# Altium schematic sheet 05_Connectors_Debug.SchDoc
size A; SheetNumber: 6; SheetTotal: 6
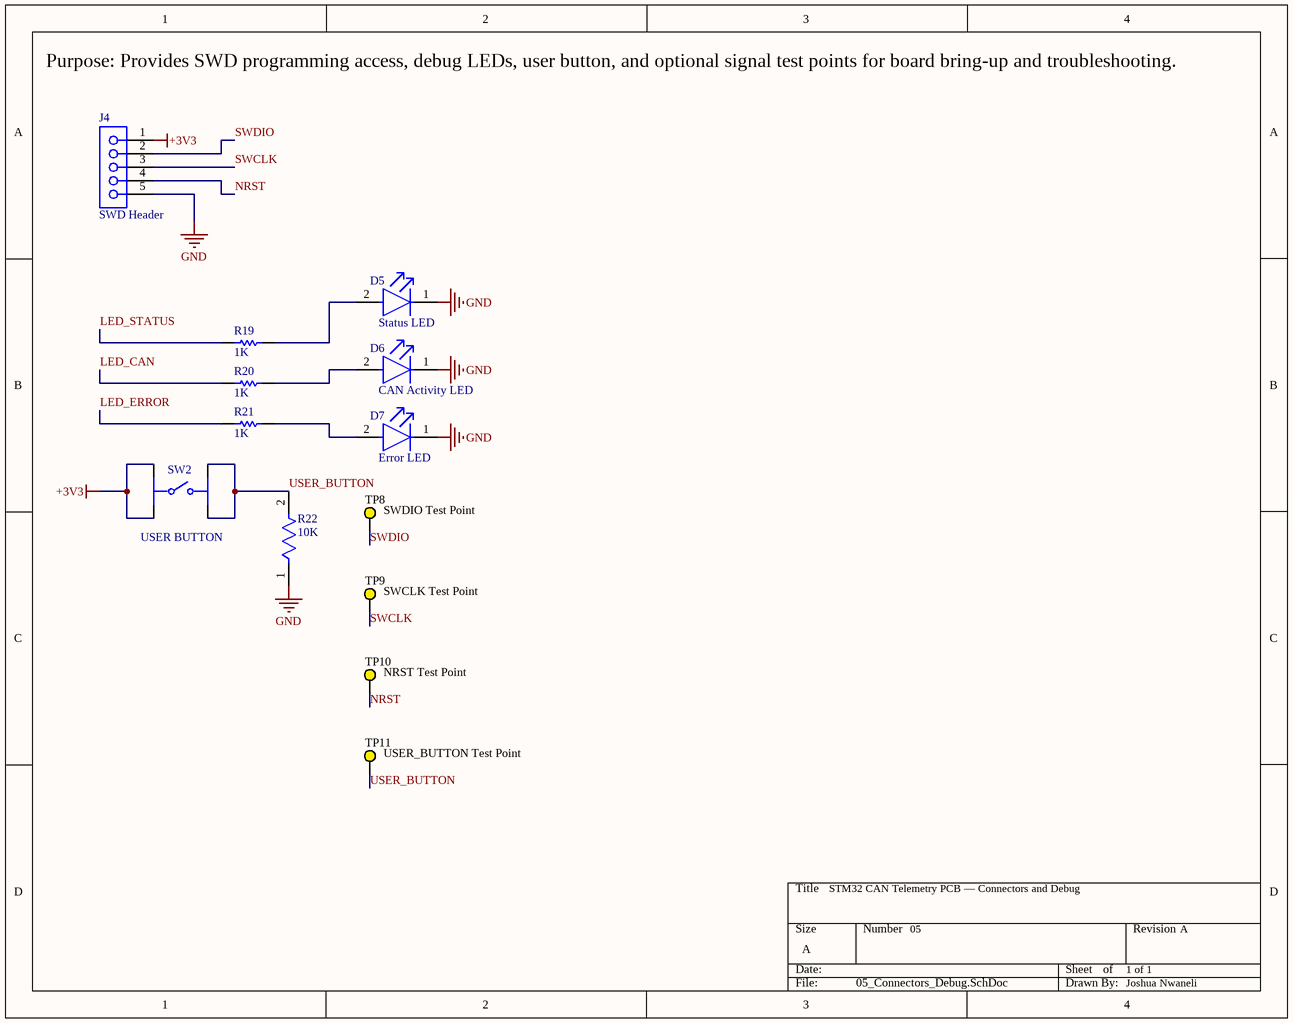
[diagram p0: 05_Connectors_Debug.SchDoc]

## Parts
D5  Status LED  [FP-SML-LXT0805IW-TR-MFG]
D6  CAN Activity LED  [FP-SML-LXT0805IW-TR-MFG]
D7  Error LED  [FP-SML-LXT0805IW-TR-MFG]
J4  SWD Header  [SMTC-SSW-105-01-X-S]
R19  1K  [RESC2013X50X30ML20T20]
R20  1K  [RESC2013X50X30ML20T20]
R21  1K  [RESC2013X50X30ML20T20]
R22  10K  [FP-CRGP0805-IPC_C]
SW2  USER BUTTON  [FP-7914J-1-032-MFG]
TP8  SWDIO Test Point  [KSTN-5014_V]
TP9  SWCLK Test Point  [KSTN-5014_V]
TP10  NRST Test Point  [KSTN-5014_V]
TP11  USER_BUTTON Test Point  [KSTN-5014_V]

## Nets
+3V3: J4.1 SW2.1_1-(1_1-) SW2.2_1-(2_1-)
GND: D5.1(C) D6.1(C) D7.1(C) J4.5 R22.1
LED_CAN: R20.1
LED_ERROR: R21.1
LED_STATUS: R19.1
NRST: J4.4 TP10.1
SWCLK: J4.3 TP9.1
SWDIO: J4.2 TP8.1
USER_BUTTON: R22.2 SW2.1_2+(1_2+) SW2.2_2+(2_2+) TP11.1
NetD5_2: D5.2(A) R19.2
NetD6_2: D6.2(A) R20.2
NetD7_2: D7.2(A) R21.2

## Notes on the sheet
- Purpose: Provides SWD programming access, debug LEDs, user button, and optional signal test points for board bring-up and troubleshooting.
- STM32 CAN Telemetry PCB — Connectors and Debug
- 05
- 1 of 1
- A
- Joshua Nwaneli

## Library data of the parts
D5-D7 = CMP-1724-00002-2: LED RED DIFFUSED SMD; Lens Style: Rectangular; Luminous Intensity: 11mcd; Approvals: UL; Test Current: 20mA; Forward Voltage: 2V; Number of LEDs: 1; Wavelength: 635nm; Lens Color: White; Viewing Angle: 140°; Min Operating Temperature: -25°C; Case Code (Metric): 2012; Mount: Surface Mount; Case Code (Imperial): 0805; Height: 0.8mm; Lead Free: Lead Free; Color: Red; Package Quantity: 1; Illumination Color: Red; Lens Transparency: Diffused; Forward Current: 20mA; Packaging: Tape and Reel; Length: 2mm; Case/Package: 0805; REACH SVHC: No SVHC; Width: 1.25mm; Number of Pins: 2; Max Operating Temperature: 80°C; Dominant Wavelength: 635nm
J4 = CMP-1023-00345-1: SQ Post Socket, Through-hole, Vertical, -55 to 105 degC, 2.54mm Pitch, 5-Pin, Female, RoHS; Manufacturer: Samtec; PartNumber: SSW-105-01-T-S; Pitch: 2.54 mm; Orientation: Vertical; ComponentLink1Description: Manufacturer URL; ComponentLink1URL: http://www.samtec.com; RoHS: True; PackageDescription: Assembly, Socket Strip .016 X .031 Tail; PackageReference: SSW-105-01-X-S; ComponentLink3URL: http://www.samtec.com/documents/webfiles/cpdf/SSW-1XX-XX-XXX-X-XX-XXX-XX-MKT.pdf; Temperature Range: -55 to 105 degC; Mounting Technology: Through-hole; PackageVersion: CA, 6/1987; ComponentLink2URL: http://www.samtec.com/documents/webfiles/pdf/SSW_TH.PDF; DatasheetVersion: F-214; ComponentLink2Description: Datasheet; ComponentLink3Description: Package Specification
R19-R21 = CMP-2001-04268-1: Manufacturer: Vishay Dale; Part Number: CRCW08051K00FKTC
R22 = CMP-03211-006861-1: CRGP 0805 10K 1%; Manufacturer Part Number: CRGP0805F10K; Manufacturer: TE; Power Rating: 0.33W; Description: CRGP0805 10KΩ 0.33W ±100ppm/°C 1% 150V; Voltage Rating: 150V; Value: 10KΩ; Tolerance: 0.01; Temperature Coefficient: ±100ppm/°C; ComponentLink2URL: https://www.mouser.com/datasheet/2/418/NG_DS_9-1773463-9_A-1358566.pdf; Temperature Range Low: -55°C; Ipc Land Pattern Name: RESC200125X55; Device Class L2: Resistors; Automotive: No; Device Class L3: Chip SMD Resistors; Composition: Thick Film; Temperature Range High: +155°C; Temperature: -55°C to +155°C; Height: 0.65mm; Series: CRGP; RoHS: TRUE; Device Class L1: Passive Components; Octopart: https://octopart.com/crgp0805f10k-te+connectivity-91018782; Package: CRGP0805; Digikey Description: CRGP 0805 10K 1%; Ambient Temperature Range High: +70°C; Lead Free: Yes; ComponentLink2Description: Datasheet; Category: Res; Resistance: 10KΩ
SW2 = CMP-07427-000007-1: Normally open user pushbutton input; Mechanical Life: 100000Cycles; Switch Function: Off-Mom; Actuator Material: Rubber; Illumination Type: Non-Illuminated; Actuator Type: Standard; Operating Force: 300gf; Throw Configuration: SPST; Current Rating: 100mA; Voltage Rating (DC): 16V; Contact Plating: Silver; Min Operating Temperature: -55°C; Series: 7914; Package Quantity: 50; Max Operating Temperature: 125°C; Depth: 5mm; Termination: J-Hook; Mount: Surface Mount; RoHS Compliant: Yes; Case/Package: SMD/SMT; Orientation: Straight; Max Current Rating: 100mA; Packaging: Rail/Tube; Length: 5mm; Contact Material: Gold
TP8-TP11 = CMP-1672-00006-4: Test Point, Yellow, Through Hole, RoHS, Bulk; Manufacturer: Keystone; PackageDescription: 1-Pin Through Hole Device, Dia 3.17 mm; REACH SVHC: No SVHC; ComponentLink2Description: Datasheet; ComponentLink2URL: http://www.keyelco.com/product-pdf.cfm?p=1323; Package Quantity: 100; Colour: Yellow; Height: 8.12 mm; RoHSCompliant: true; Contact Material: Bronze; Mount: Through Hole; Contact Plating: Silver; ComponentLink1URL: http://www.keyelco.com/; Packaging: Bulk; Mounting Technology: Through Hole; PackageReference: 5014; ComponentLink1Description: Manufacturer URL; DatasheetVersion: Rev. F, 12/2013